# EAGLE design rivian_a (EAGLE 9.6.2)
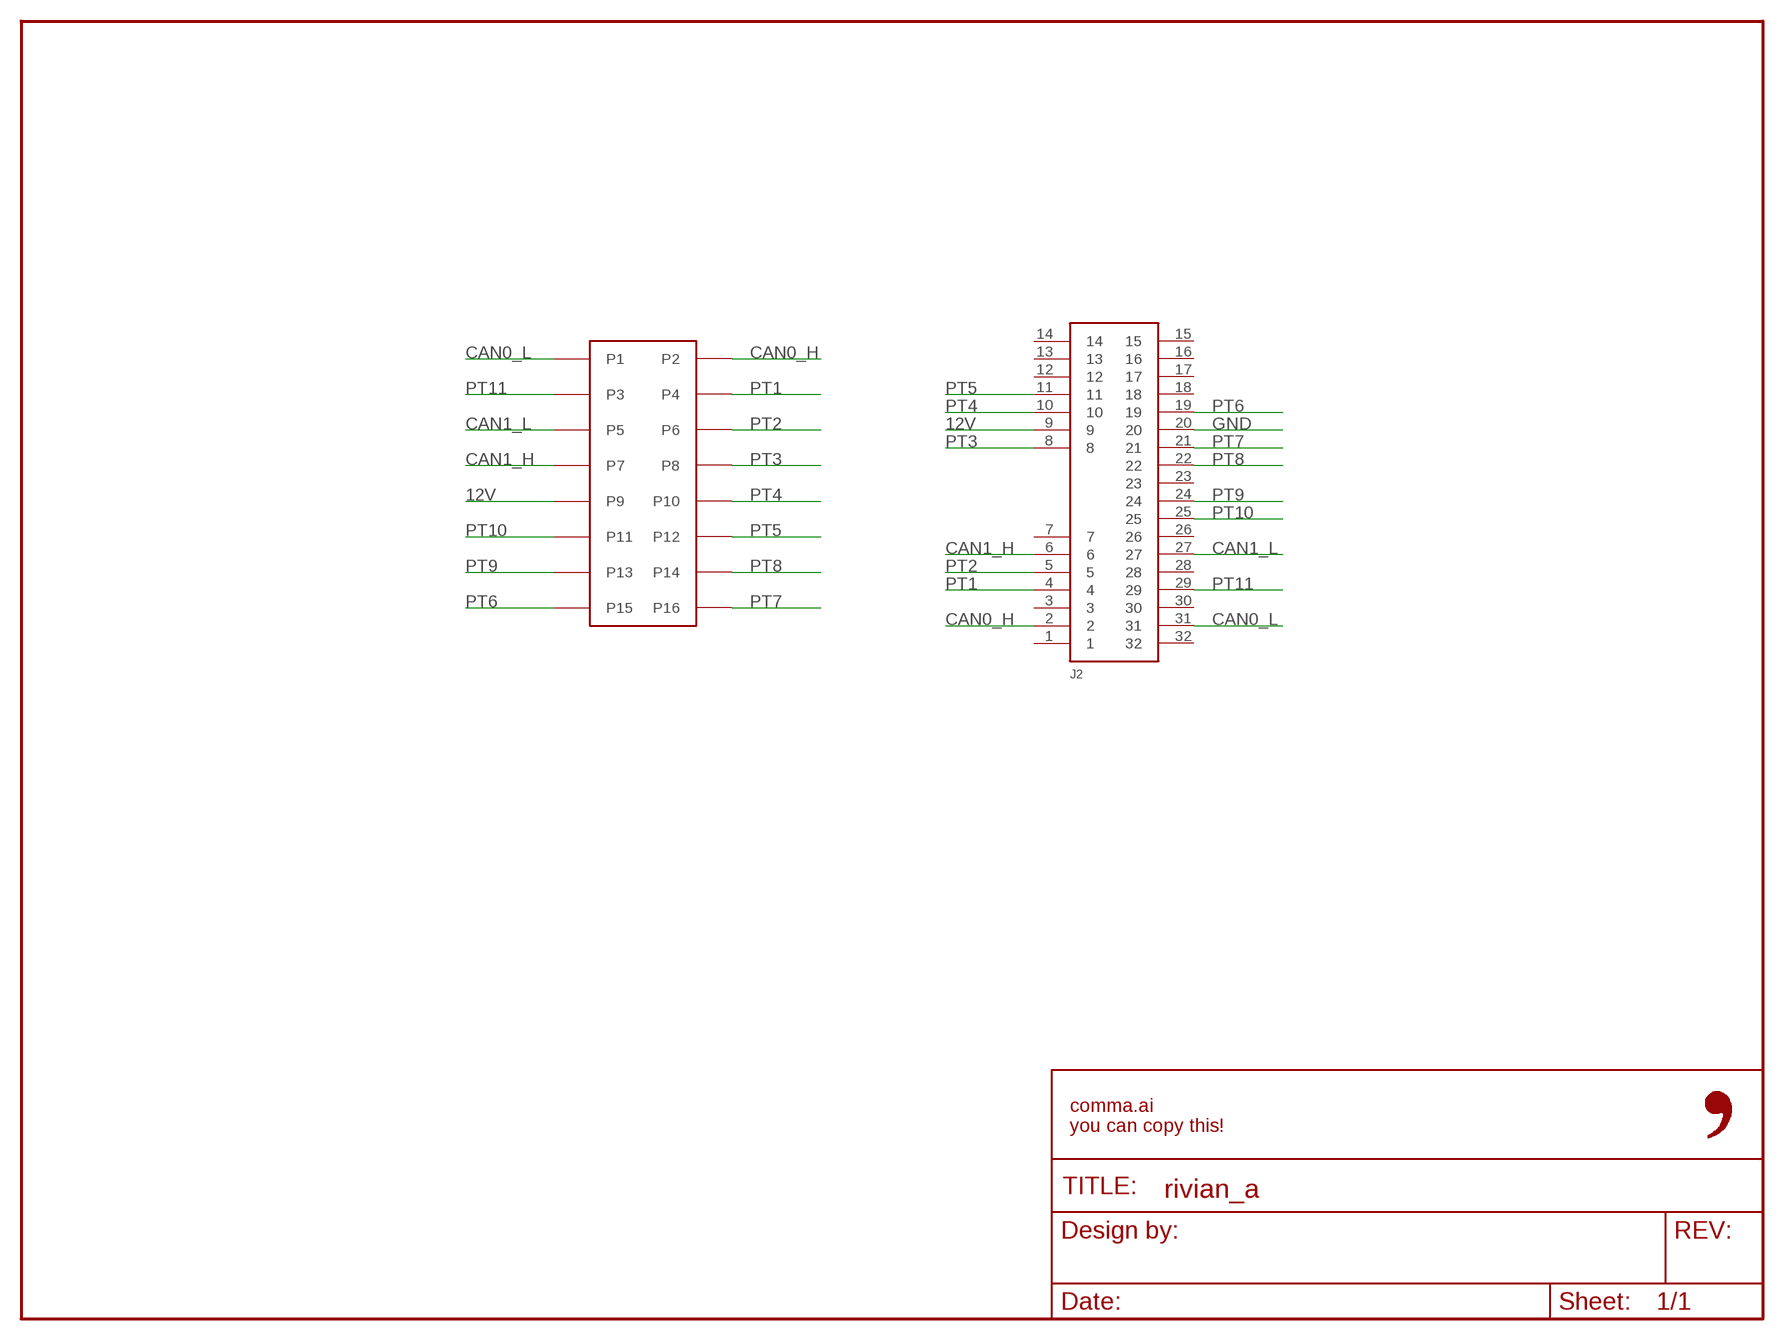
[diagram p0: schematic, sheet 1]

## Parts
FRAME1  FRAME-LETTER-OPENNO_PACKAGE  [DUMMY]
J1  5018761640  [5018761640]
J2  2177419-3  [2177419-3]

## Nets
12V: J1.P9 J2.9
CAN0_H: J1.P2 J2.2
CAN0_L: J1.P1 J2.31
CAN1_H: J1.P7 J2.6
CAN1_L: J1.P5 J2.27
GND: J2.20
PT1: J1.P4 J2.4
PT2: J1.P6 J2.5
PT3: J1.P8 J2.8
PT4: J1.P10 J2.10
PT5: J1.P12 J2.11
PT6: J1.P15 J2.19
PT7: J1.P16 J2.21
PT8: J1.P14 J2.22
PT9: J1.P13 J2.24
PT10: J1.P11 J2.25
PT11: J1.P3 J2.29
Unconnected: J2.1 J2.3 J2.7 J2.12 J2.13 J2.14 J2.15 J2.16 J2.17 J2.18 J2.23 J2.26 J2.28 J2.30 J2.32

## Library data of the parts
FRAME1 = comma.ai:FRAME-LETTER-OPEN: Schematic Frame - Letter Standard 8.5x11 US Letter frame; DESIGNER: Nobody; VERSION: v01
J1 = comma.ai:5018761640; CPN: CAI-501876-1640
J2 = comma.ai:2177419-3; CPN: CAI-4-2177419-3

## Board
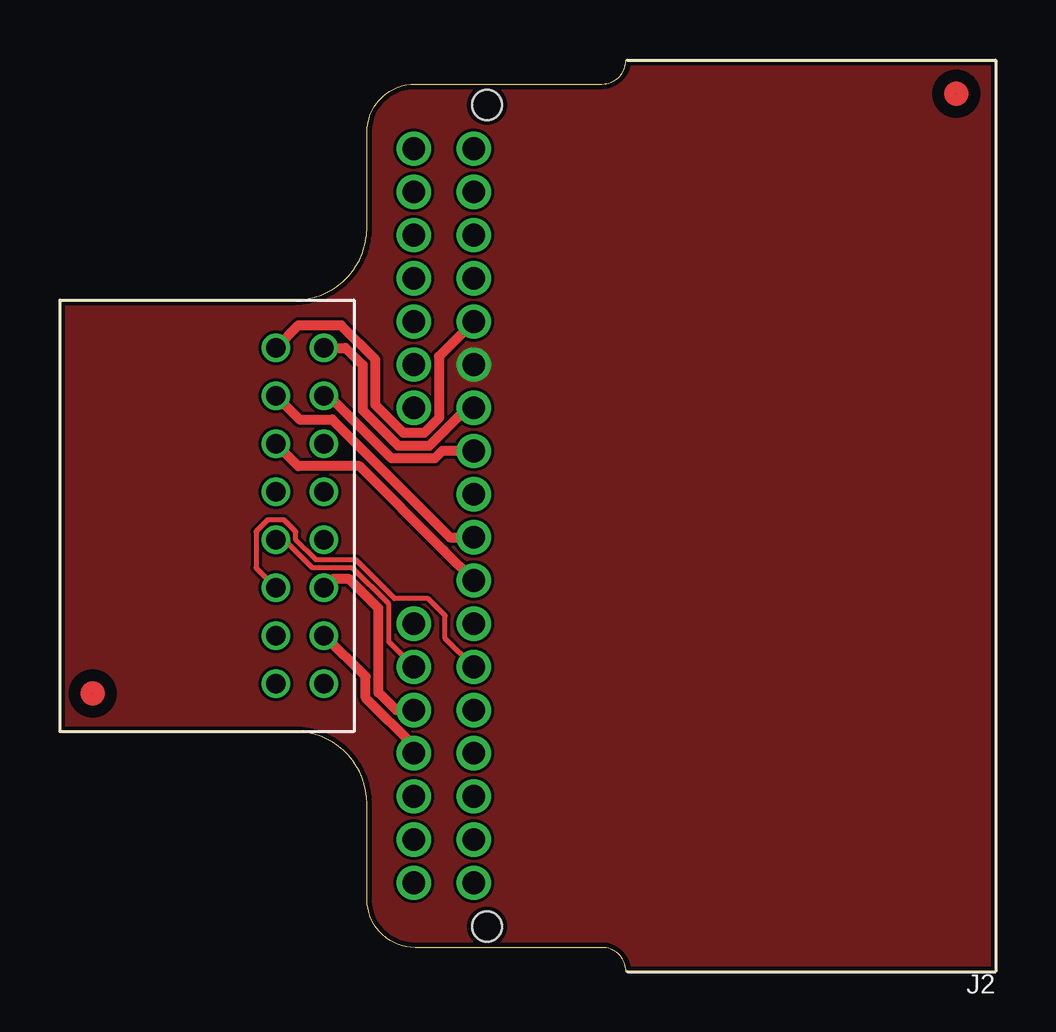
[diagram p1: board, top side]
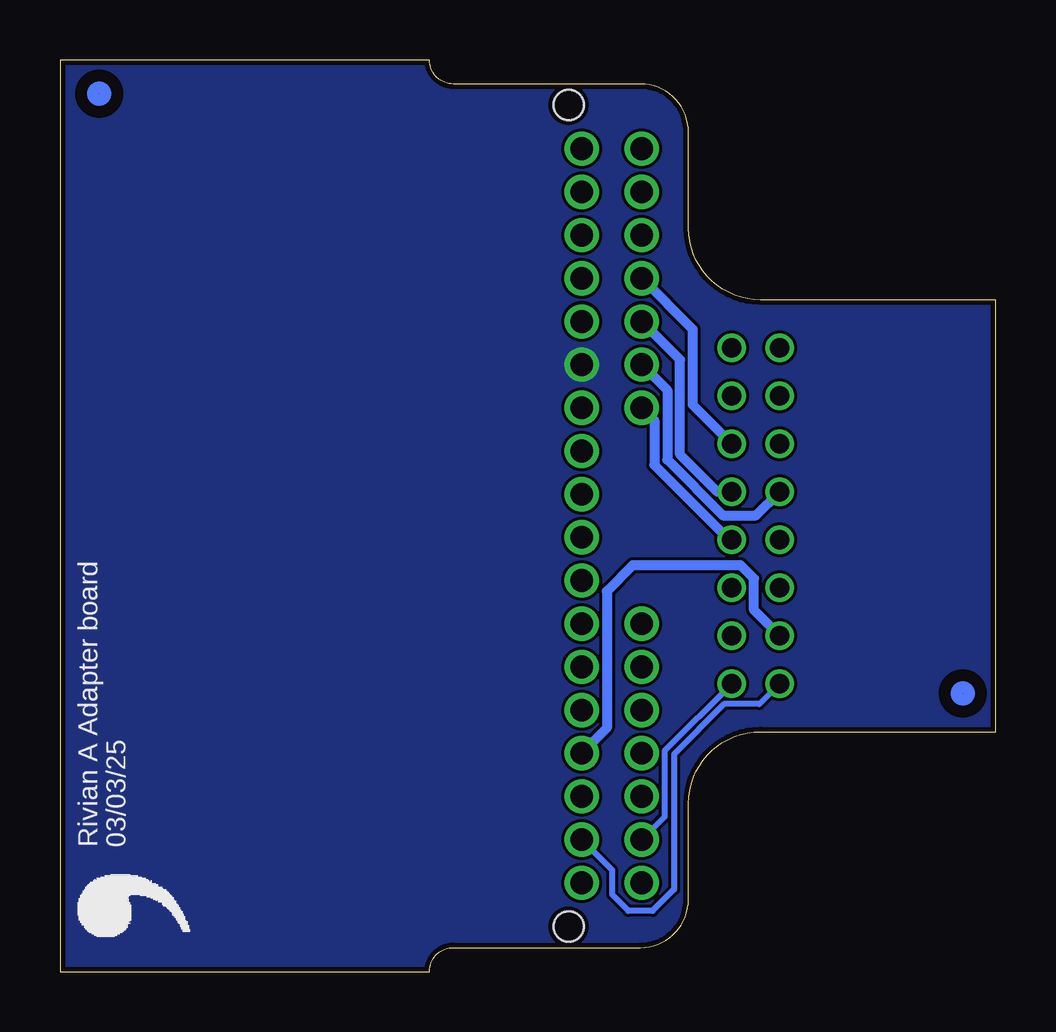
[diagram p2: board, bottom side, seen from below]

Size 39 x 38 mm. Coordinates in mm from the lower left corner, seen from the top.
Outline: 0,28 9.8,28 arc90 12.8,31 12.8,35 arc-90 14.8,37 22.6,37 arc90 23.6,38 39,38 39,0 23.6,0 arc90 22.6,1 14.8,1 arc-90 12.8,3 12.8,7 arc90 9.8,10 0,10 0,28
Copper layers (1*16): Top 0.035mm / dielectric 1.5mm / Bottom 0.035mm
Design rules "jlcpcb_2layer": minimum track width 5mil, minimum drill 12mil, track to track 5mil, track to pad 5mil, pad to pad 5mil, via to via 5mil, smd to smd 5mil, copper to edge 8mil, drill to drill 8mil, minimum pad ring 3mil, minimum via ring 3mil, stop-mask expansion 4mm, vias tented up to drill 20mil, thermal gap 10mil

### Footprints (pad centres in the part's own frame; a part is rotated, then mirrored left to right if it is on the bottom)
5018761640 = drill 0.8: P1 7,-1; P2 7,1; P3 5,-1; P4 5,1; P5 3,-1; P6 3,1; P7 1,-1; P8 1,1; P9 -1,-1; P10 -1,1; P11 -3,-1; P12 -3,1; P13 -5,-1; P14 -5,1; P15 -7,-1; P16 -7,1
2177419-3 = drill 0.95: 1 15.3,-1.25; 2 13.5,-1.25; 3 11.7,-1.25; 4 9.9,-1.25; 5 8.1,-1.25; 6 6.3,-1.25; 7 4.5,-1.25; 8 -4.5,-1.25; 9 -6.3,-1.25; 10 -8.1,-1.25; 11 -9.9,-1.25; 12 -11.7,-1.25; 13 -13.5,-1.25; 14 -15.3,-1.25; 15 -15.3,1.25; 16 -13.5,1.25; 17 -11.7,1.25; 18 -9.9,1.25; 19 -8.1,1.25; 20 -6.3,1.25; 21 -4.5,1.25; 22 -2.7,1.25; 23 -0.9,1.25; 24 0.9,1.25; 25 2.7,1.25; 26 4.5,1.25; 27 6.3,1.25; 28 8.1,1.25; 29 9.9,1.25; 30 11.7,1.25; 31 13.5,1.25; 32 15.3,1.25 | hole 1.25: 17.125,1.8; -17.125,1.8

### Placement (x,y rotation side)
FRAME1  13,19 0 top
J1  10,19 270 top
J2  16,19 270 top
U$1  [LOGO]  33.28,0.78 90 bottom
U$2  [FIDUCIAL]  37.37,36.59 0 top
U$3  [FIDUCIAL]  1.37,11.59 0 top

### Tracks (layer width: path | path; a pad name or v marks a point on that pad's centre or on a via)
12V
  Bottom 0.406: J2.9 13.69,24.24 13.69,21.34 11.37,19.02 9.98,19.02 J1.P9
CAN0_H
  Bottom 0.254: J2.2 13.78,6.47 13.78,9.22 J1.P2
CAN0_L
  Bottom 0.254: J1.P1 9.85,11.15 11.31,11.15 13.4,9.06 13.4,3.43 14.3,2.53 15.3,2.53 15.97,3.2 15.97,4.22 J2.31
CAN1_H
  Top 0.203: J2.6 13.71,13.74 13.71,15.31 12.2,16.83 10.53,16.83 9.36,18 J1.P7
CAN1_L
  Top 0.203: J2.27 16.05,13.89 16.05,14.83 15.34,15.55 13.95,15.55 12.33,17.16 10.67,17.16 9.83,18 9.83,18.34 9.34,18.83 8.66,18.83 8.17,18.34 8.17,16.83 J1.P5
GND
  pour Bottom (no thermals): -2,40 41,40 41,22 41,-2 3,-2 -2,-2
  pour Top (no thermals): -3,41 42,41 42,-3 -3,-3
PT1
  Top 0.406: J2.4 14.75,9.4 12.75,11.41 12.75,12.29 11.04,14 J1.P4
PT2
  Top 0.406: J2.5 14.01,10.9 13.28,11.63 13.28,15.14 12.06,16.36 11.36,16.36 J1.P6
PT3
  Bottom 0.406: J2.8 14.22,22.97 14.22,21.12 11.1,18 J1.P8
PT4
  Bottom 0.406: J1.P10 11.59,20 13.15,21.56 13.15,25.5 J2.10
PT5
  Bottom 0.406: J1.P12 12.62,23.62 12.62,26.77 J2.11
PT6
  Top 0.406: J2.19 15.79,25.64 15.79,23.07 15.18,22.46 14.32,22.46 13.15,23.62 13.15,25.5 11.72,26.93 9.93,26.93 J1.P15
PT7
  Top 0.406: J1.P16 11.9,26 12.62,25.28 12.62,23.4 14.1,21.92 15.4,21.92 16.98,23.5 J2.21
PT8
  Top 0.406: J2.22 15.93,21.7 15.62,21.39 13.82,21.39 11.22,24 J1.P14
PT9
  Top 0.406: J1.P13 9.99,23.01 11.35,23.01 16.26,18.1 J2.24
PT10
  Top 0.406: J2.25 16,17.55 16,17.56 12.48,21.07 9.93,21.07 J1.P11
PT11
  Bottom 0.406: J1.P3 10.07,15.07 10.07,16.38 10.62,16.93 15.13,16.93 16.21,15.85 16.21,10.16 17.25,9.12 J2.29

### Text on the board
bNames: 03/03/25 | Rivian A Adapter board